# EAGLE design Arduino (EAGLE 9.5.2)
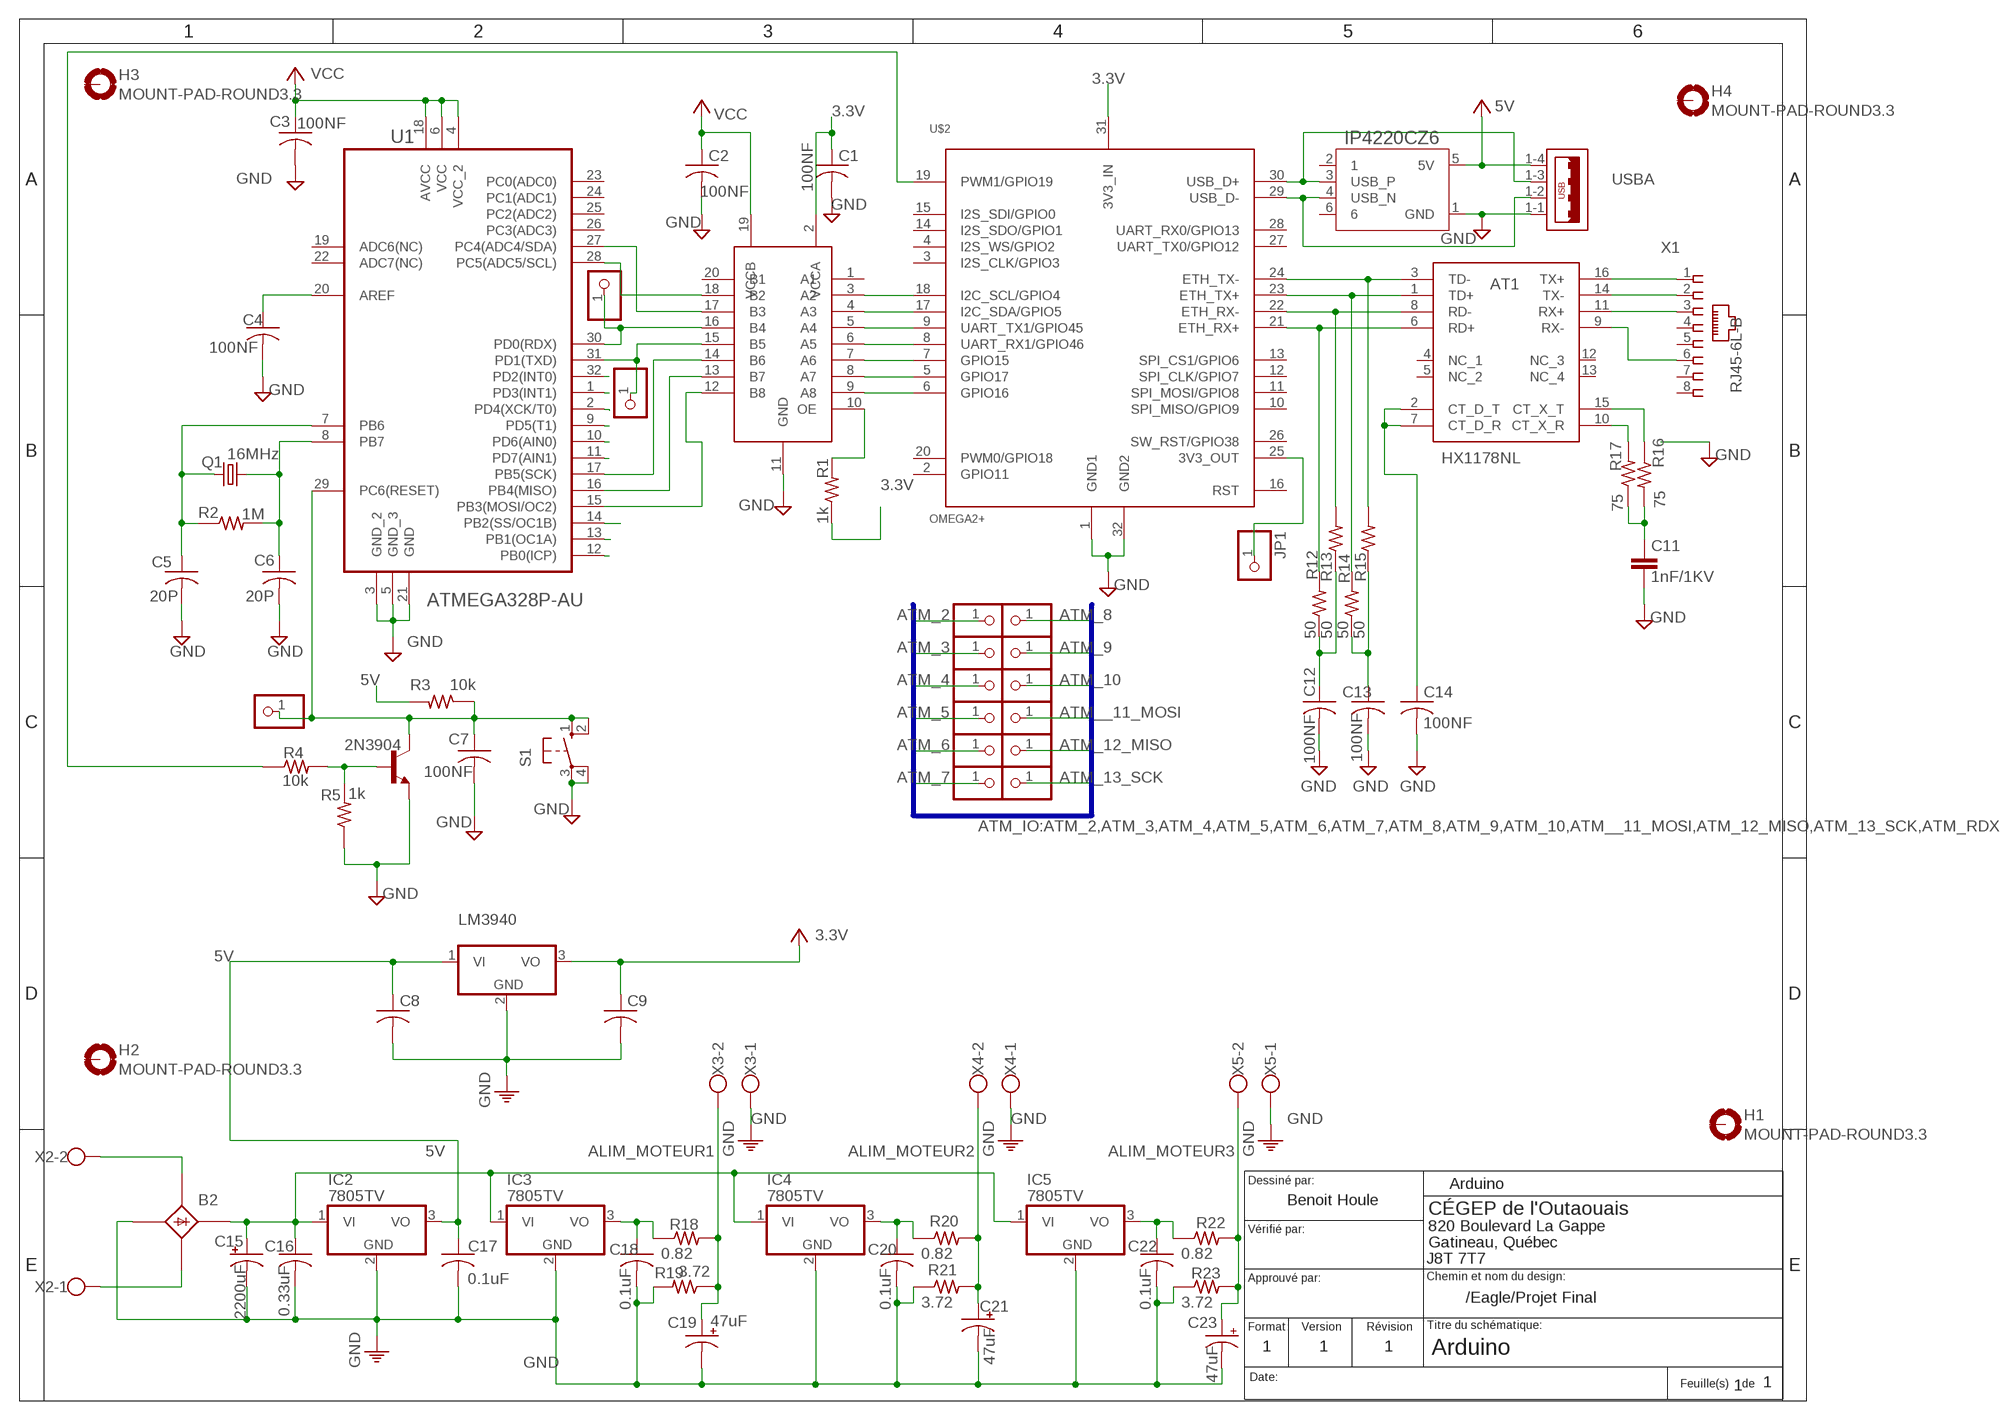
[diagram p0: schematic, sheet 1]

## Parts
AT1  HX1178NL  [SOP254P1283X647-16N]
B2  B25A-  [B25A-]
C1  100NF  CENPC0603K  [C0603K]
C2  100NF  CENPC0603K  [C0603K]
C3  100NF  CENPC0603K  [C0603K]
C4  100NF  CENPC0603K  [C0603K]
C5  20P  CENPC0603K  [C0603K]
C6  20P  CENPC0603K  [C0603K]
C7  100NF  CENPC0603K  [C0603K]
C8  CENPC1206K  [C1206K]
C9  CENPC1206K  [C1206K]
C11  1nF/1KV  CXC10B6  [XC10B6]
C12  100NF  CENPC0603K  [C0603K]
C13  100NF  CENPC0603K  [C0603K]
C14  100NF  CENPC0603K  [C0603K]
C15  2200uF  CPOL-USSANYO_B'  [SANYO-OSCON_B']
C16  0.33uF  CENPC0603K  [C0603K]
C17  0.1uF  CENPC0603K  [C0603K]
C18  0.1uF  CENPC0603K  [C0603K]
C19  47uF  CPOL-USSANYO_B'  [SANYO-OSCON_B']
C20  0.1uF  CENPC0603K  [C0603K]
C21  47uF  CPOL-USSANYO_B'  [SANYO-OSCON_B']
C22  0.1uF  CENPC0603K  [C0603K]
C23  47uF  CPOL-USSANYO_B'  [SANYO-OSCON_B']
FRAME1  CARTOUCHE_TGÉ  [CARTOUCHE]
H1  MOUNT-PAD-ROUND3.3  [3,3-PAD]
H2  MOUNT-PAD-ROUND3.3  [3,3-PAD]
H3  MOUNT-PAD-ROUND3.3  [3,3-PAD]
H4  MOUNT-PAD-ROUND3.3  [3,3-PAD]
IC2  7805TV  [TO220V]
IC3  7805TV  [TO220V]
IC4  7805TV  [TO220V]
IC5  7805TV  [TO220V]
IP4220CZ6  IP4220CZ6,125DIODE_SOT457_1P7X3P1-M  [DIODE_SOT457_1P7X3P1-M]
JP1  PINHD-1X1  [1X01]
JP2  PINHD-1X1  [1X01]
JP3  PINHD-1X1  [1X01]
JP4  PINHD-1X1  [1X01]
JP5  PINHD-1X1  [1X01]
JP6  PINHD-1X1  [1X01]
JP7  PINHD-1X1  [1X01]
JP8  PINHD-1X1  [1X01]
JP9  PINHD-1X1  [1X01]
JP10  PINHD-1X1  [1X01]
JP11  PINHD-1X1  [1X01]
JP12  PINHD-1X1  [1X01]
JP13  PINHD-1X1  [1X01]
JP14  PINHD-1X1  [1X01]
JP15  PINHD-1X1  [1X01]
JP16  PINHD-1X1  [1X01]
LM3940  7824TV  [TO220V]
Q1  16MHz  CRYSTALHC49S  [HC49/S]
R1  1k  RM1206  [M1206]
R2  1M  RM1206  [M1206]
R3  10k  RM1206  [M1206]
R4  10k  RM1206  [M1206]
R5  1k  RM3216  [M3216]
R12  50  RM1206  [M1206]
R13  50  RM1206  [M1206]
R14  50  RM1206  [M1206]
R15  50  RM1206  [M1206]
R16  75  RM1206  [M1206]
R17  75  RM1206  [M1206]
R18  0.82  R0309/10  [0309/10]
R19  3.72  R0309/10  [0309/10]
R20  0.82  R0309/10  [0309/10]
R21  3.72  R0309/10  [0309/10]
R22  0.82  R0309/10  [0309/10]
R23  3.72  R0309/10  [0309/10]
S1  10-XX  [B3F-10XX]
U1  ATMEGA328P-AU  [QFP80P900X900X120-32N]
U$1  TXS0108E  [TSSOP20]
U$2  OMEGA2+  [OMEGA2_PADS]
USB  USB_2P85-32003-00X-1  [USB2]
VERIFIER_TYPE  2N3904  [TO92]
X1  RJ45-6L-B  [RJ45-NO-SHIELD]
X2  W237-102  [W237-102]
X3  W237-102  [W237-102]
X4  W237-102  [W237-102]
X5  W237-102  [W237-102]

## Nets
3.3V: C1.1 C9.1 LM3940.3(VO) R1.1 U$1.2(VCCA) U$2.31(3V3_IN)
5V: C2.1 C3.1 C8.1 C17.1 IC2.3(VO) IP4220CZ6.5(5V) LM3940.1(VI) R3.2 U1.4(VCC_2) U1.6(VCC) U1.18(AVCC) U$1.19(VCCB) USB.1-4 ; supply symbol labelled VCC
ALIM_MOTEUR1: C19.+ R18.2 R19.1 X3.2
ALIM_MOTEUR2: C21.+ R20.2 R21.2 X4.2
ALIM_MOTEUR3: C23.+ R22.2 R23.2 X5.2
ATM_2: JP3.1 U1.32(PD2(INT0))
ATM_3: JP4.1 U1.1(PD3(INT1))
ATM_4: JP7.1 U1.2(PD4(XCK/T0))
ATM_5: JP8.1 U1.9(PD5(T1))
ATM_6: JP9.1 U1.10(PD6(AIN0))
ATM_7: JP10.1 U1.11(PD7(AIN1))
ATM_8: JP11.1 U1.12(PB0(ICP))
ATM_9: JP12.1 U1.13(PB1(OC1A))
ATM_10: JP13.1 U1.14(PB2(SS/OC1B))
ATM_12_MISO: JP15.1 U1.16(PB4(MISO)) U$1.13(B7)
ATM_13_SCK: JP16.1 U1.17(PB5(SCK)) U$1.14(B6)
ATM__11_MOSI: JP14.1 U1.15(PB3(MOSI/OC2)) U$1.12(B8)
ATM_RDX: JP5.1 U1.30(PD0(RDX)) U$1.16(B4)
ATM_SCI: U1.28(PC5(ADC5/SCL)) U$1.18(B2)
ATM_SDA: U1.27(PC4(ADC4/SDA)) U$1.17(B3)
ATM_TDX: JP6.1 U1.31(PD1(TXD)) U$1.15(B5)
GND: B2.-1(-) C1.2 C2.2 C3.2 C4.2 C5.2 C6.2 C7.2 C8.2 C9.2 C11.2 C12.2 C13.2 C14.2 C15.- C16.2 C17.2 C18.2 C19.- C20.2 C21.- C22.2 C23.- IC2.2(GND) IC3.2(GND) IC4.2(GND) IC5.2(GND) IP4220CZ6.1(GND) LM3940.2(GND) R5.1 R19.2 R21.1 R23.1 S1.3(P) S1.4(P1) U1.3(GND_2) U1.5(GND_3) U1.21(GND) U$1.11(GND) U$2.1(GND1) U$2.32(GND2) USB.1-1 VERIFIER_TYPE.3(E) X3.1 X4.1 X5.1
MCU_RESET: C7.1 JP2.1 R3.1 S1.1(S) S1.2(S1) U1.29(PC6(RESET)) VERIFIER_TYPE.1(C)
N$1: R1.2 U$1.10(OE)
N$2: C4.1 U1.20(AREF)
N$3: C6.1 Q1.2 R2.2 U1.8(PB7)
N$4: C5.1 Q1.1 R2.1 U1.7(PB6)
N$6: C11.1 R16.2 R17.1
N$7: AT1.2(CT_D_T) AT1.7(CT_D_R) C14.1
N$8: AT1.15(CT_X_T) R16.1
N$9: AT1.10(CT_X_R) R17.2
N$10: R4.1 U$2.19(PWM1/GPIO19)
N$11: B2.AC1-(AC1) X2.2
N$12: B2.AC2-(AC2) X2.1
N$13: C18.1 IC3.3(VO) R18.1
N$15: C20.1 IC4.3(VO) R20.1
N$18: C22.1 IC5.3(VO) R22.1
N$25: R4.2 R5.2 VERIFIER_TYPE.2(B)
N$28: IP4220CZ6.3(USB_P) U$2.30(USB_D+) USB.1-3
N$30: IP4220CZ6.4(USB_N) U$2.29(USB_D-) USB.1-2
N$36: AT1.3(TD-) R15.2 U$2.24(ETH_TX-)
N$37: AT1.1(TD+) R14.2 U$2.23(ETH_TX+)
N$38: AT1.8(RD-) R13.2 U$2.22(ETH_RX-)
N$39: AT1.6(RD+) R12.2 U$2.21(ETH_RX+)
N$40: AT1.16(TX+) X1.1
N$41: AT1.14(TX-) X1.2
N$42: AT1.11(RX+) X1.3
N$43: AT1.9(RX-) X1.6
N$47: C12.1 R12.1 R13.1
N$48: C13.1 R14.1 R15.1
OM_IO15: U$1.7(A6) U$2.7(GPIO15)
OM_IO16: U$1.9(A8) U$2.6(GPIO16)
OM_IO17: U$1.8(A7) U$2.5(GPIO17)
OM_RXD1: U$1.6(A5) U$2.8(UART_RX1/GPIO46)
OM_SCI: U$1.3(A2) U$2.18(I2C_SCL/GPIO4)
OM_SDA: U$1.4(A3) U$2.17(I2C_SDA/GPIO5)
OM_TXD1: U$1.5(A4) U$2.9(UART_TX1/GPIO45)
TP_3.3_OMEGA: JP1.1 U$2.25(3V3_OUT)
VIN_7805: B2.+1(+) C15.+ C16.1 IC2.1(VI) IC3.1(VI) IC4.1(VI) IC5.1(VI)
Unconnected: AT1.4(NC_1) AT1.5(NC_2) AT1.12(NC_3) AT1.13(NC_4) B2.+ B2.- B2.AC1 B2.AC2 H1.B3,3(MOUNT) H2.B3,3(MOUNT) H3.B3,3(MOUNT) H4.B3,3(MOUNT) IP4220CZ6.2 IP4220CZ6.6 U1.19(ADC6(NC)) U1.22(ADC7(NC)) U1.23(PC0(ADC0)) U1.24(PC1(ADC1)) U1.25(PC2(ADC2)) U1.26(PC3(ADC3)) U$1.1(A1) U$1.20(B1) U$2.2(GPIO11) U$2.3(I2S_CLK/GPIO3) U$2.4(I2S_WS/GPIO2) U$2.10(SPI_MISO/GPIO9) U$2.11(SPI_MOSI/GPIO8) U$2.12(SPI_CLK/GPIO7) U$2.13(SPI_CS1/GPIO6) U$2.14(I2S_SDO/GPIO1) U$2.15(I2S_SDI/GPIO0) U$2.16(RST) U$2.20(PWM0/GPIO18) U$2.26(SW_RST/GPIO38) U$2.27(UART_TX0/GPIO12) U$2.28(UART_RX0/GPIO13) USB.2-1 USB.2-2 USB.2-3 USB.2-4 X1.4 X1.5 X1.7 X1.8

## Buses
ATM_IO:ATM_2,ATM_3,ATM_4,ATM_5,ATM_6,ATM_7,ATM_8,ATM_9,ATM_10,ATM__11_MOSI,ATM_12_MISO,ATM_13_SCK,ATM_RDX,ATM_TDX

## Notes on the sheet
- Arduino
- Benoit Houle
- /Eagle/Projet Final
- 1 | 1 | 1
- 1 | 1

## Library data of the parts
AT1 = SamacSys_Parts:HX1178NL: Audio Transformers / Signal Transformers 10/100Base-T SMD 1-Port Source: Datasheet <https://ms.componentsearchengine.com/Datasheets/1/HX1178NL.pdf>; DESCRIPTION: Audio Transformers / Signal Transformers 10/100Base-T SMD 1-Port; HEIGHT: 6.47mm; MANUFACTURER_NAME: Pulse; MANUFACTURER_PART_NUMBER: HX1178NL
B2 = rectifier:B25A-: RECTIFIER 25-A bridge
C1-C9 C12-C14 C16-C18 C20 C22 = 1_TGE-sur G:CENP: Condensateur electrolytique non-polarisé
C11 = 1_TGE-sur G:C: Condensateur
C15 C19 C21 C23 = rcl:CPOL-US: POLARIZED CAPACITOR, American symbol; SPICEPREFIX: C
FRAME1 = 1_TGE-sur G:CARTOUCHE_TGÉ: Cartouche de TGÉ: Grandeur A, dimention 8 1/2 x 11 pouces, orientation portrait. Les élèves doivent utiliser la commande TEXT pour placer les valeurs aux champs appropriés. Couche 100 Cartouche, ne pas oublier de créer cette couche! Size par défaut: 0,07 ou ajusté en conséquence si pas asez d'espace. Ratio: 8% Font: Vector. Voir la commande TEXT pour plus d'information.
H1-H4 = holes:MOUNT-PAD-ROUND: MOUNTING PAD, round
IC2-IC5 LM3940 = linear:78*: Positive VOLTAGE REGULATOR Source: http://cache.national.com/ds/LM/LM78L05.pdf http://www.fairchildsemi.com/ds/LM/LM7805.pdf
IP4220CZ6 = IP4220CZ6:IP4220CZ6,125; BUILT_BY: EMA_Anthony; COPYRIGHT: Copyright (C) 2016 Accelerated Designs. All rights reserved; MANUFACTURER_PART_NUMBER: IP4220CZ6,125; VENDOR: Nexperia
JP1-JP16 = 1mylib:PINHD-1X1: PIN HEADER
Q1 = crystal:CRYSTAL: CRYSTAL; OC_FARNELL: 1667008; OC_NEWARK: unknown
R1-R5 R12-R23 = 1_TGE-sur G:R: R
S1 = switch-omron:10-XX: OMRON SWITCH; MPN: B3F-1000; OC_FARNELL: 176432; OC_NEWARK: 36M3542
U1 = Atmel_By_element14_Batch_1-00:ATMEGA328P-AU: 8-bit Microcontroller with In-System Programmable Flash; MPN: ATMEGA328P-AU; OC_FARNELL: 1715486; OC_NEWARK: 14R4631; PACKAGE: TQFP-32; SUPPLIER: Atmel
U$1 = Synapseware-transistors:TXS0108E: 8-BIT BIDIRECTIONAL VOLTAGE-LEVEL TRANSLATOR FOR OPEN-DRAIN AND PUSH-PULL APPLICATIONS
U$2 = OnionOmega2:OMEGA2+: Onion Omega2+; FLASH: 32MB; RAM: 128MB
USB = 1_TGE-sur G:USB_2P
VERIFIER_TYPE = transistor:2N3904: NPN TRANSISTOR
X1 = con-tycoelectronics:RJ45: CORCOM Modular RJ Jacks No Shield Source: www.tycoelectronics.com .. ENG_DS_1654001_1099_RJ_L_0507.pdf; MPN: RJ45-6L-B; OC_FARNELL: unknown; OC_NEWARK: 16R6090
X2-X5 = con-wago-500:W237-102: WAGO SCREW CLAMP; MPN: 237-102; OC_FARNELL: unknown; OC_NEWARK: 70K9898

## Board
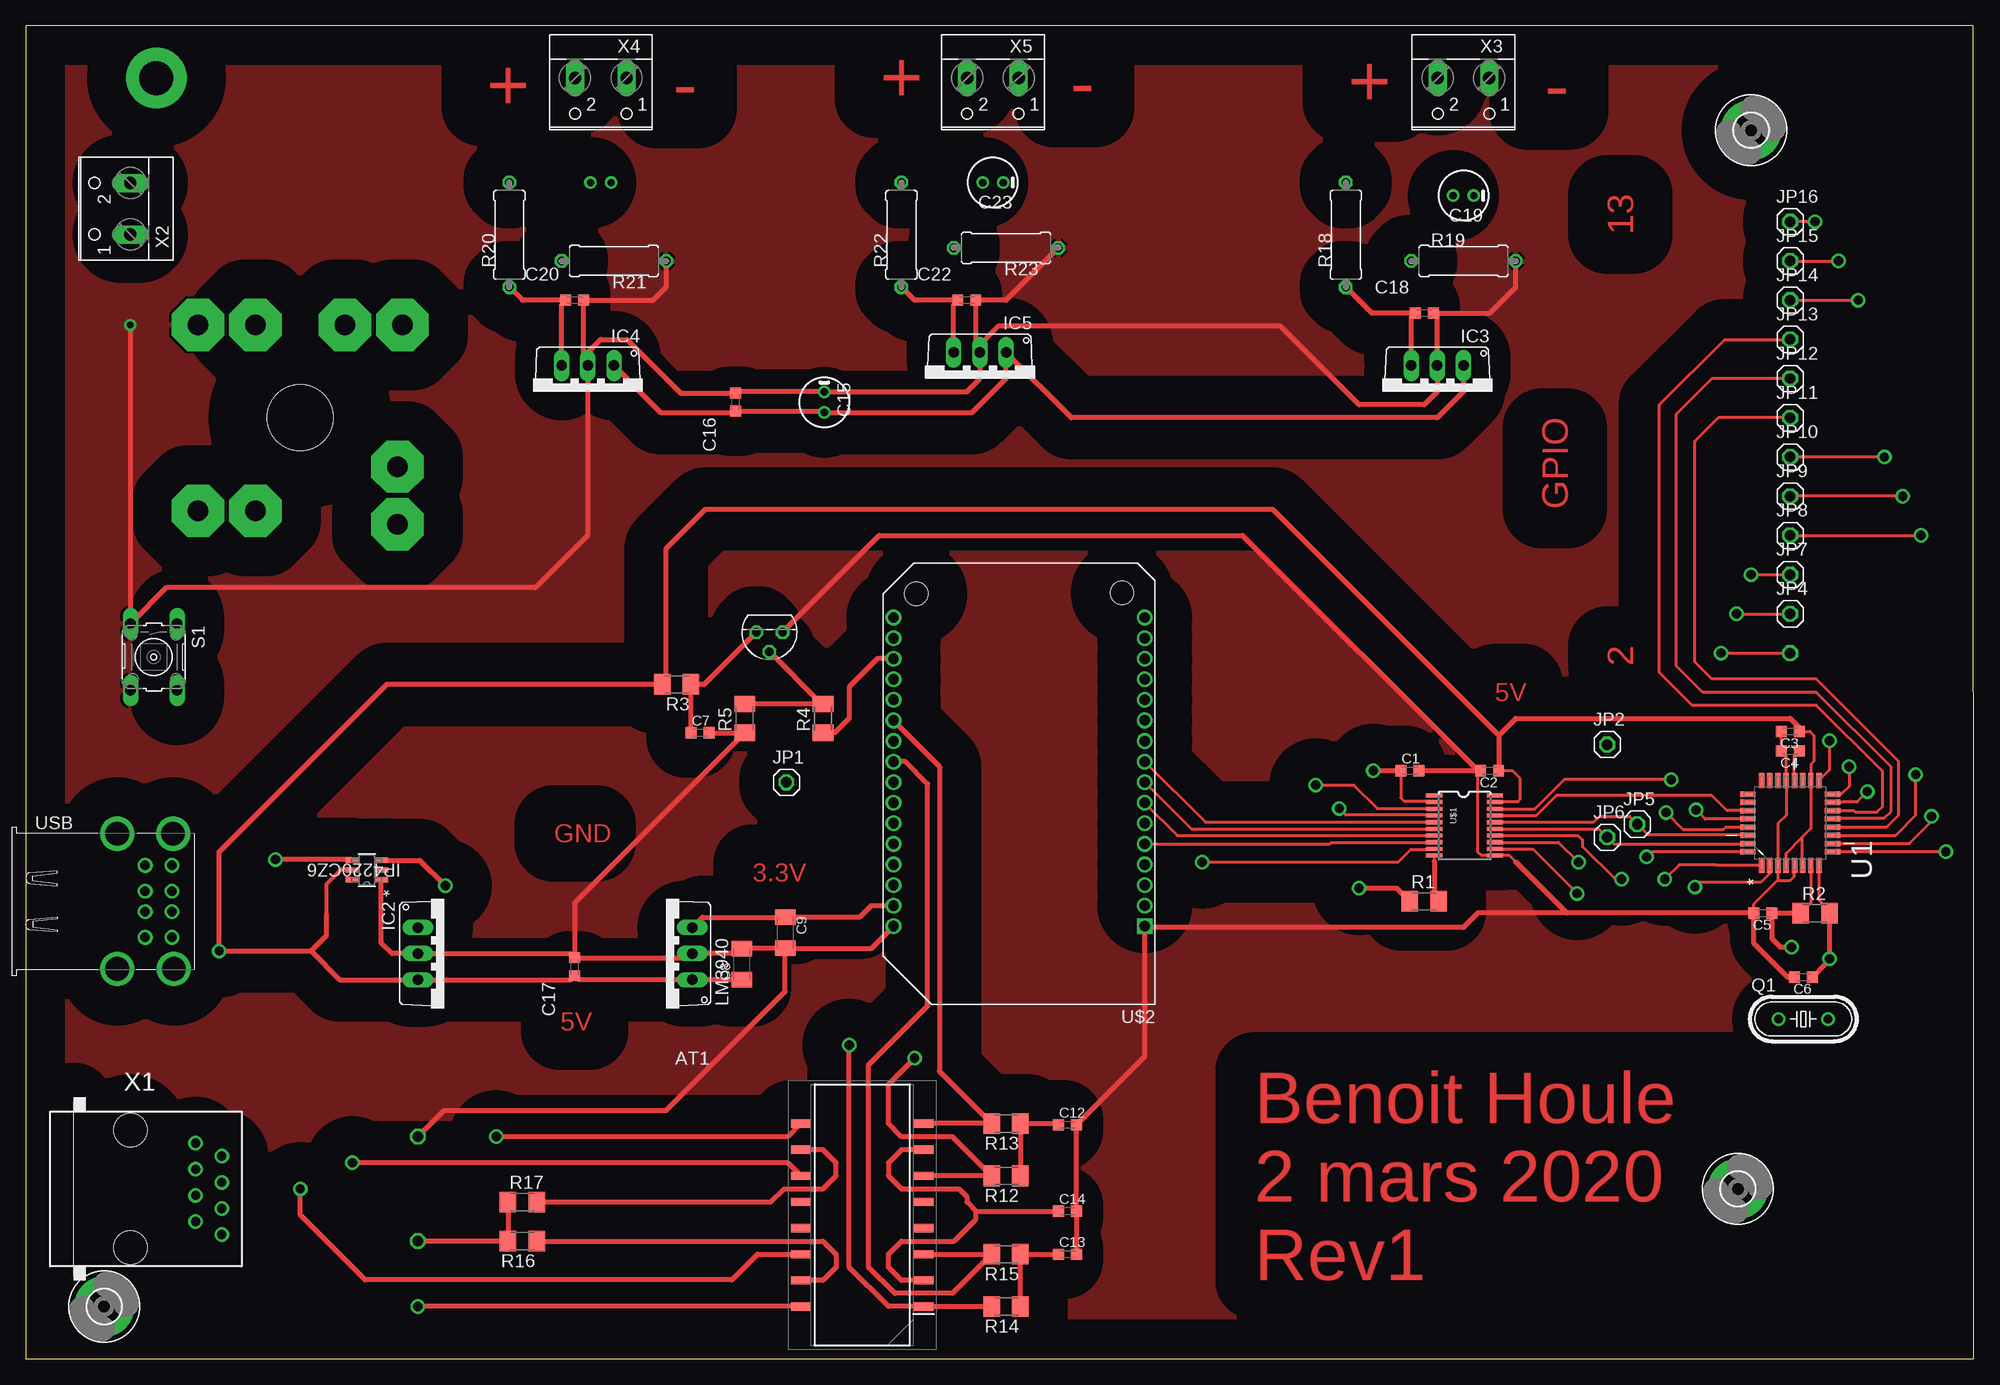
[diagram p1: board, top side]
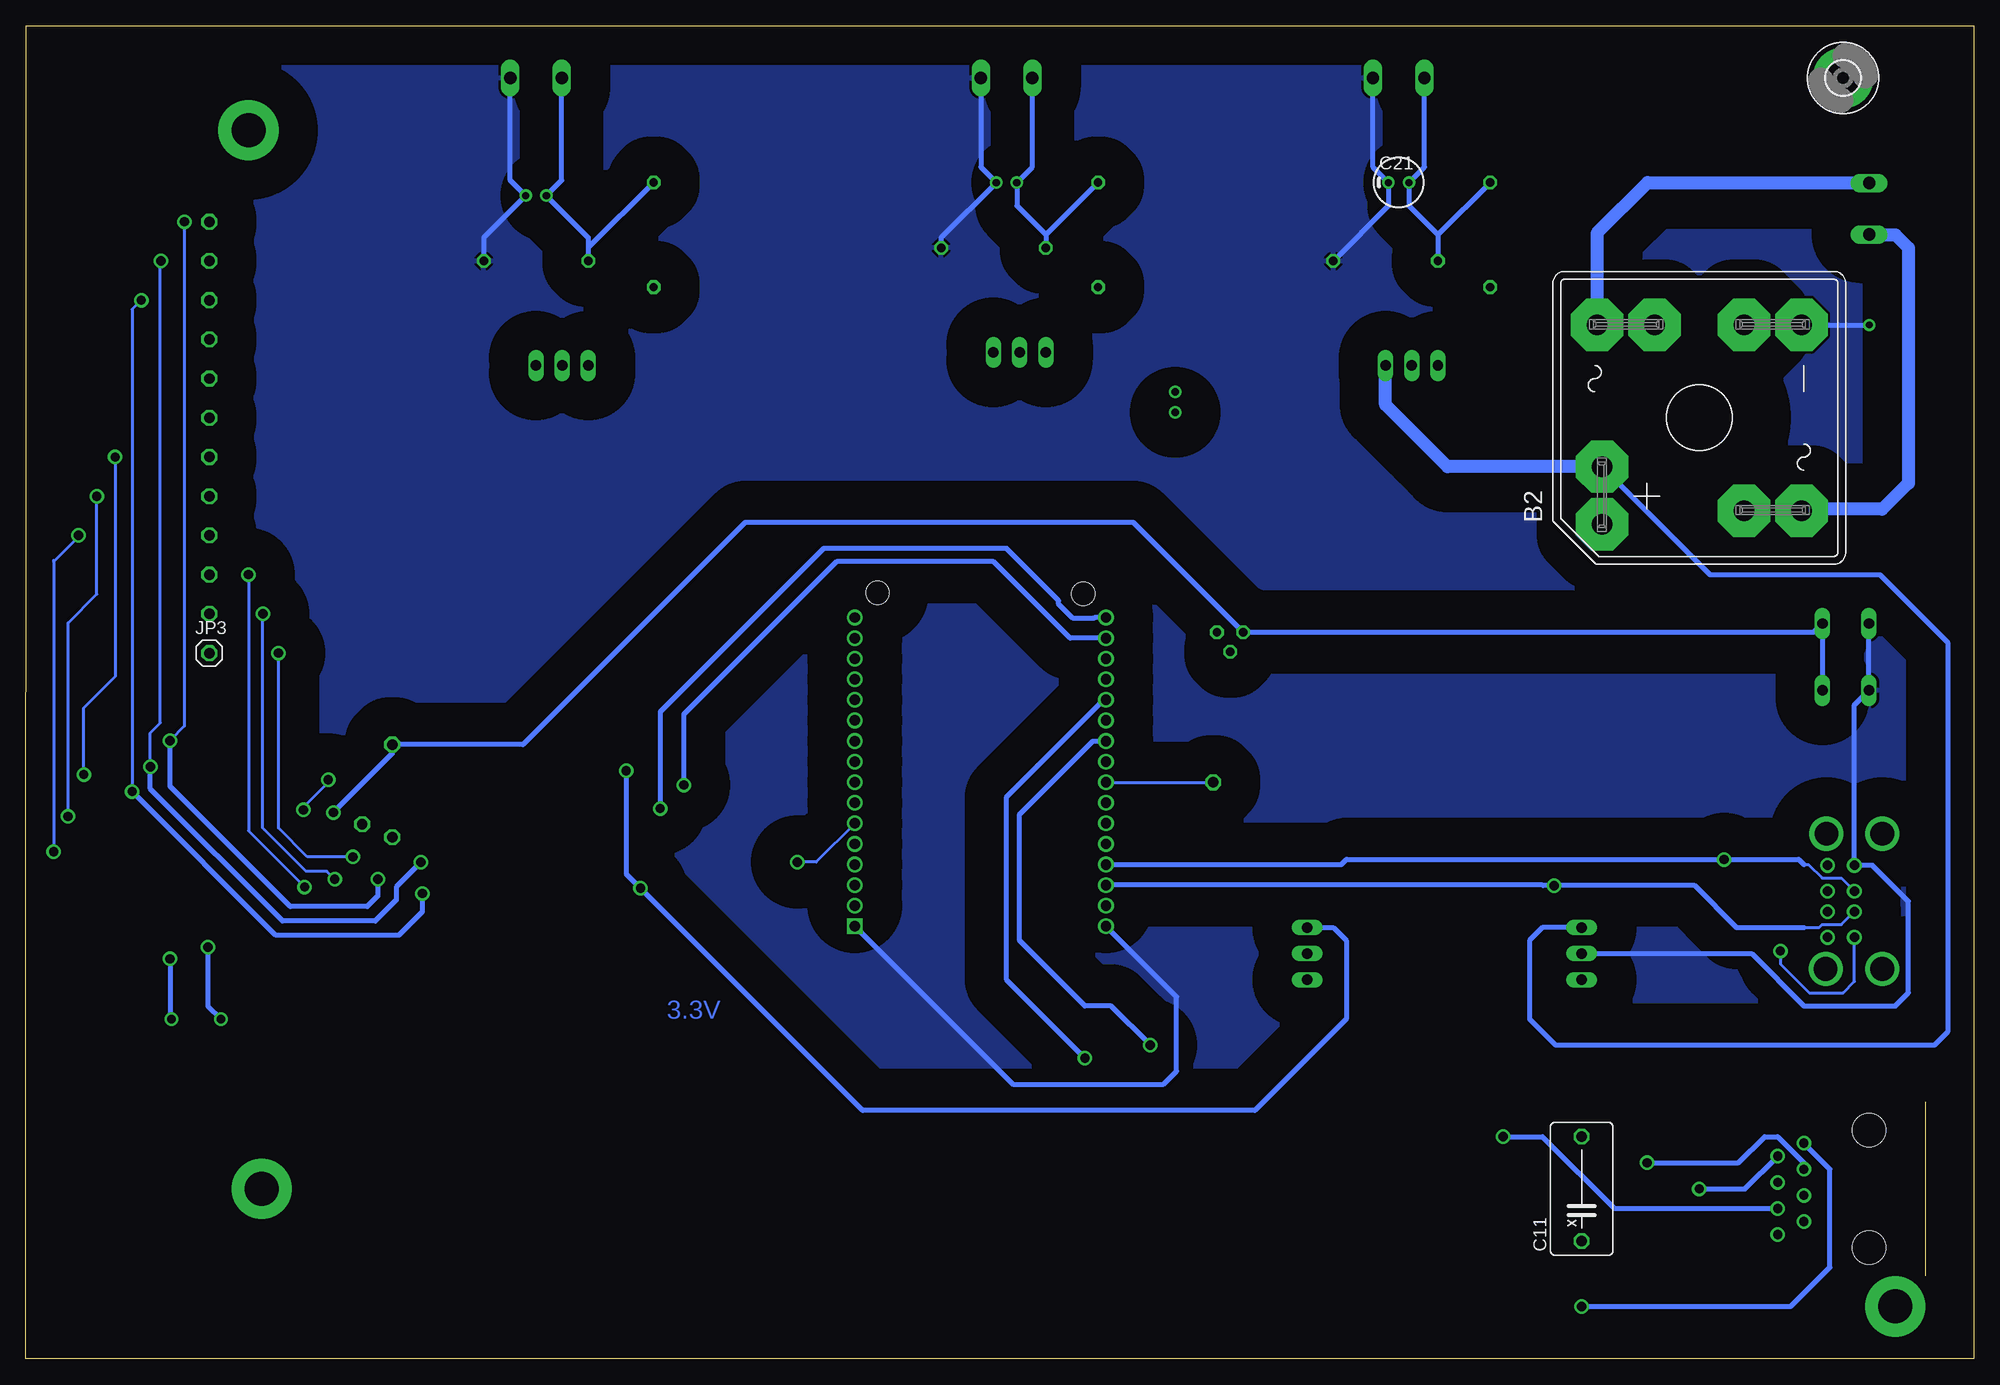
[diagram p2: board, bottom side, seen from below]

Size 189.28 x 129.54 mm. Coordinates in mm from the lower left corner, seen from the top.
Outline: 0,0 189.28,0 189.23,129.54 0,129.53 0,0
Copper layers (1*16): Top 0.035mm / dielectric 1.5mm / Bottom 0.035mm
Design rules "default *": minimum track width 10mil, minimum drill 10mil, track to track 10mil, track to pad 15mil, pad to pad 15mil, via to via 20mil, smd to smd 20mil, copper to edge 20mil, drill to drill 10mil, minimum pad ring 10mil, minimum via ring 10mil, stop-mask expansion 20mil, vias tented up to drill 10mil, thermal gap 10mil

### Footprints (pad centres in the part's own frame; a part is rotated, then mirrored left to right if it is on the bottom)
SOP254P1283X647-16N = smd 1.97 x 0.8: 1 -5.94,8.89; 2 -5.94,6.35; 3 -5.94,3.81; 4 -5.94,1.27; 5 -5.94,-1.27; 6 -5.94,-3.81; 7 -5.94,-6.35; 8 -5.94,-8.89; 9 5.94,-8.89; 10 5.94,-6.35; 11 5.94,-3.81; 12 5.94,-1.27; 13 5.94,1.27; 14 5.94,3.81; 15 5.94,6.35; 16 5.94,8.89
B25A- = drill 2.007 pad 5.08 octagon: + -10.338,9.449; +1 -4.75,9.449; - 9.042,-4.343; -1 9.042,-9.931; AC1 9.042,4.343; AC1- 9.042,9.931; AC2 -9.042,-4.343; AC2- -9.042,-9.931 | hole 6.401: 0,0
C0603K = smd 1.05 x 1.08: 1 -0.875,0; 2 0.875,0
C1206K = smd 1.5 x 2: 1 -1.5,0; 2 1.5,0
XC10B6 = drill 1.016 octagon: 1 -5.08,0; 2 5.08,0
SANYO-OSCON_B' = drill 0.7 pad 1.1: + 1,0; - -1,0
3,3-PAD = drill 3.3 pad 5.842: B3,3 0,0
TO220V = drill 1.016 long: 1 -2.54,-2.54; 2 0,-2.54; 3 2.54,-2.54
DIODE_SOT457_1P7X3P1-M = smd 1.308 x 0.508: 1 -1.403,0.95; 2 -1.403,0; 3 -1.403,-0.95; 4 1.403,-0.95; 5 1.403,0; 6 1.403,0.95
1X01 = drill 1.016 octagon: 1 0,0
HC49/S = drill 0.813: 1 -2.413,0; 2 2.413,0
M1206 = smd 1.6 x 2: 1 -1.4,0; 2 1.4,0
M3216 = smd 1.6 x 2: 1 -1.4,0; 2 1.4,0
0309/10 = drill 0.813 octagon: 1 -5.08,0; 2 5.08,0
B3F-10XX = drill 1.016 long: 1 -3.251,2.261; 2 3.251,2.261; 3 -3.251,-2.261; 4 3.251,-2.261
QFP80P900X900X120-32N = smd 1.473 x 0.508: 1 -4.115,2.794; 2 -4.115,2.007; 3 -4.115,1.194; 4 -4.115,0.406; 5 -4.115,-0.406; 6 -4.115,-1.194; 7 -4.115,-2.007; 8 -4.115,-2.794; 17 4.115,-2.794; 18 4.115,-2.007; 19 4.115,-1.194; 20 4.115,-0.406; 21 4.115,0.406; 22 4.115,1.194; 23 4.115,2.007; 24 4.115,2.794 | smd 0.508 x 1.473: 9 -2.794,-4.115; 10 -2.007,-4.115; 11 -1.194,-4.115; 12 -0.406,-4.115; 13 0.406,-4.115; 14 1.194,-4.115; 15 2.007,-4.115; 16 2.794,-4.115; 25 2.794,4.115; 26 2.007,4.115; 27 1.194,4.115; 28 0.406,4.115; 29 -0.406,4.115; 30 -1.194,4.115; 31 -2.007,4.115; 32 -2.794,4.115
TSSOP20 = smd 0.4 x 1.6: 1 -2.675,-2.85; 2 -2.025,-2.85; 3 -1.375,-2.85; 4 -0.725,-2.85; 5 -0.075,-2.85; 6 0.575,-2.85; 7 1.225,-2.85; 8 1.875,-2.85; 9 2.525,-2.85; 10 3.175,-2.85; 11 3.175,3.05; 12 2.525,3.05; 13 1.875,3.05; 14 1.225,3.05; 15 0.575,3.05; 16 -0.075,3.05; 17 -0.725,3.05; 18 -1.375,3.05; 19 -2.025,3.05; 20 -2.675,3.05
OMEGA2_PADS = drill 1.015 square: 1 -12.2,13.85 | drill 1.015: 2 -12.2,11.85; 3 -12.2,9.85; 4 -12.2,7.85; 5 -12.2,5.85; 6 -12.2,3.85; 7 -12.2,1.85; 8 -12.2,-0.15; 9 -12.2,-2.15; 10 -12.2,-4.15; 11 -12.2,-6.15; 12 -12.2,-8.15; 13 -12.2,-10.15; 14 -12.2,-12.15; 15 -12.2,-14.15; 16 -12.2,-16.15; 17 12.2,-16.15; 18 12.2,-14.15; 19 12.2,-12.15; 20 12.2,-10.15; 21 12.2,-8.15; 22 12.2,-6.15; 23 12.2,-4.15; 24 12.2,-2.15; 25 12.2,-0.15; 26 12.2,1.85; 27 12.2,3.85; 28 12.2,5.85; 29 12.2,7.85; 30 12.2,9.85; 31 12.2,11.85; 32 12.2,13.85 | hole 2.25: 10,-18.45; -10,-18.55
USB2 = drill 0.92 pad 1.27: 1-1 2.71,3.5; 1-2 2.71,1; 1-3 2.71,-1; 1-4 2.71,-3.5; 2-1 5.33,3.5; 2-2 5.33,1; 2-3 5.33,-1; 2-4 5.33,-3.5 | drill 2.3 pad 3: M1 0,6.57; M2 0,-6.57; M3 5.426,6.57; M4 5.502,-6.57
TO92 = drill 0.813 octagon: 1 1.27,0; 2 0,1.905; 3 -1.27,0
RJ45-NO-SHIELD = drill 0.9 pad 1.4: 1 -4.445,6.35; 2 -3.175,8.89; 3 -1.905,6.35; 4 -0.635,8.89; 5 0.635,6.35; 6 1.905,8.89; 7 3.175,6.35; 8 4.445,8.89 | hole 3.251: -5.715,0; 5.715,0
W237-102 = drill 1.194 long: 1 -2.5,-1.27; 2 2.5,-1.27

### Placement (x,y rotation side)
AT1  81.28,13.97 180 top
B2  26.67,91.44 90 bottom
C1  134.49,57.15 0 top
C2  142.24,57.15 180 top
C3  171.45,60.96 180 top
C4  171.45,59.05 180 top
C5  168.78,43.31 180 top
C6  172.72,37.08 180 top
C7  65.53,60.83 0 top
C8  69.6,38.35 90 top
C9  73.79,41.4 270 top
C11  38.1,16.51 90 bottom
C12  101.22,22.73 0 top
C13  101.22,10.16 0 top
C14  101.22,14.35 0 top
C15  77.6,92.96 270 top
C16  68.96,92.96 90 top
C17  53.34,38.1 90 top
C18  135.89,101.6 0 top
C19  139.7,113.03 180 top
C20  53.34,102.87 0 top
C21  55.88,114.3 0 bottom
C22  91.44,102.87 0 top
C23  93.98,114.3 180 top
FRAME1  -38.1,-55.88 0 top  (outside the outline)
H1  12.7,124.46 0 bottom
H2  166.37,16.51 0 top
H3  167.64,119.38 0 top
H4  7.62,5.08 0 top
IC2  40.64,39.37 270 top
IC3  137.16,93.98 180 top
IC4  54.61,93.98 180 top
IC5  92.71,95.25 180 top
IP4220CZ6  33.15,47.5 180 top
JP1  73.91,56.01 0 top
JP2  153.67,59.69 0 top
JP3  171.45,68.58 0 bottom
JP4  171.45,72.39 0 top
JP5  156.59,51.94 0 top
JP6  153.67,50.67 0 top
JP7  171.45,76.2 0 top
JP8  171.45,80.01 0 top
JP9  171.45,83.82 0 top
JP10  171.45,87.63 0 top
JP11  171.45,91.44 0 top
JP12  171.45,95.25 0 top
JP13  171.45,99.06 0 top
JP14  171.45,102.87 0 top
JP15  171.45,106.68 0 top
JP16  171.45,110.49 0 top
LM3940  62.23,39.37 90 top
Q1  172.72,33.02 0 top
R1  135.89,44.45 0 top
R2  173.86,43.31 0 top
R3  63.25,65.53 180 top
R4  77.47,62.23 90 top
R5  69.85,62.23 90 top
R12  95.25,17.78 180 top
R13  95.25,22.86 180 top
R14  95.25,5.08 180 top
R15  95.25,10.16 180 top
R16  48.26,11.43 180 top
R17  48.26,15.24 0 top
R18  128.27,109.22 90 top
R19  139.7,106.68 0 top
R20  46.99,109.22 90 top
R21  57.15,106.68 180 top
R22  85.09,109.22 90 top
R23  95.25,107.95 180 top
S1  12.45,68.2 270 top
U1  171.45,52.07 90 top
U$1  139.7,52.07 270 top
U$2  96.52,55.88 180 top
USB  8.89,44.45 0 top
VERIFIER_TYPE  72.26,70.61 180 top
X1  10.16,16.51 270 top
X2  8.89,111.76 90 top
X3  139.7,123.19 180 top
X4  55.88,123.19 180 top
X5  93.98,123.19 180 top

### Tracks (layer width: path | path; a pad name or v marks a point on that pad's centre or on a via)
3.3V  (via drill 0.9)
  Top 0.305: U$1.2 136.81,54.14 133.98,54.14 133.61,54.5 C1.1
  Top 0.508: LM3940.3 65.76,42.9 C9.1 81,42.9 82.13,44.03 U$2.31 | v130.94,57.15 C1.1 | R1.1 133.22,45.72 v129.54,45.72
  Bottom 0.508: LM3940.3 62.23,41.91 60.96,40.64 60.96,33.02 69.85,24.13 107.95,24.13 v129.54,45.72 130.94,47.12 v130.94,57.15
5V  (via drill 0.9)
  Top 0.305: U$1.19 142.79,54.14 144.99,54.14 145.23,54.38 145.23,56.38 144.46,57.15 C2.1 | 172.52,60.76 C3.1 173.36,60.96 173.74,60.58 173.74,58.04 173.46,57.76 U1.18 173.46,51.54 172.64,50.72 | 172.64,50.72 171.04,49.12 U1.4 | U1.6 172.64,50.72
  Top 0.406: IP4220CZ6.5 30.61,47.5 29.21,46.1 29.21,43.14
  Top 0.508: C8.1 64.79,36.85 LM3940.1 53.73,36.83 C17.1 52.95,36.83 IC2.3 30.52,36.83 27.73,39.62 | 27.73,39.62 v18.8,39.62 18.8,49.28 35.05,65.53 R3.2 62.23,65.92 62.23,78.74 66.04,82.55 121.16,82.55 143.13,60.58 | 143.13,60.58 143.13,57.16 C2.1 | 172.52,60.76 172.52,61.16 171.45,62.23 144.78,62.23 143.13,60.58 | 29.21,43.14 29.21,41.11 27.73,39.62
  Bottom 0.305: USB.1-4 11.6,36.66 12.7,35.56 16,35.56 18.8,38.35 v18.8,39.62
ALIM_MOTEUR1
  Bottom 0.508: X3.2 137.2,114.53 C19.+ 134.62,108.95 134.62,107.95 | R18.2 134.62,107.95 | 134.62,107.95 R19.1
ALIM_MOTEUR2
  Bottom 0.508: X4.2 53.38,115.8 C21.+ 54.88,112.03 52.07,109.22 | R20.2 52.07,109.22 | 52.07,109.22 R21.2
ALIM_MOTEUR3
  Bottom 0.508: X5.2 91.48,115.8 C23.+ 92.98,112.03 90.17,109.22 | R22.2 90.17,109.22 | 90.17,109.22 R23.2
ATM_2  (via drill 0.9)
  Top 0.305: U1.32 157.99,49.28 v157.48,48.77 | v164.72,68.58 JP3.1
  Bottom 0.305: v157.48,48.77 161.93,48.77 164.72,51.56 v164.72,68.58
ATM_3  (via drill 0.9)
  Top 0.305: U1.1 164.26,47.95 164.21,48.01 160.66,48.01 v159.26,46.61 | v166.24,72.39 JP4.1
  Bottom 0.305: v159.26,46.61 160.02,47.37 162.05,47.37 166.24,51.56 v166.24,72.39
ATM_4  (via drill 0.9)
  Top 0.305: v162.18,45.85 162.64,46.3 168.57,46.3 169.44,47.18 U1.2 | v167.64,76.2 JP7.1
  Bottom 0.305: v162.18,45.85 167.64,51.31 v167.64,76.2
ATM_5  (via drill 0.9)
  Top 0.305: JP8.1 v184.15,80.01 | v186.56,49.28 U1.9
  Bottom 0.305: 186.56,77.6 186.56,77.47 | 186.56,77.47 v186.56,49.28 | 186.56,77.47 184.15,79.88 v184.15,80.01
ATM_6  (via drill 0.9)
  Top 0.305: U1.10 183.03,50.06 185.17,52.2 v185.17,52.7 | v182.37,83.82 JP9.1
  Bottom 0.305: v185.17,52.7 185.17,71.5 182.37,74.3 v182.37,83.82
ATM_7  (via drill 0.9)
  Top 0.305: U1.11 181.69,50.88 183.64,52.83 v183.64,56.77 | v180.59,87.63 JP10.1
  Bottom 0.305: v183.64,56.77 183.64,63.25 180.59,66.29 v180.59,87.63
ATM_8
  Top 0.305: JP11.1 164.47,91.44 162.18,89.15 162.18,67.69 163.83,66.04 173.99,66.04 181.99,58.04 181.99,52.83 180.85,51.69 175.59,51.69 U1.12
ATM_9
  Top 0.305: JP12.1 163.83,95.25 160.4,91.82 160.4,67.31 162.94,64.77 173.99,64.77 181.25,57.51 181.25,53.21 180.6,52.56 175.65,52.56 U1.13
ATM_10
  Top 0.305: U1.14 177.63,53.26 177.77,53.12 179.86,53.12 180.44,53.69 180.44,57.05 173.99,63.5 161.93,63.5 158.75,66.68 158.75,92.71 165.1,99.06 JP13.1
ATM_12_MISO  (via drill 0.9)
  Top 0.305: U$1.13 148.94,50.2 v150.88,48.26 | JP15.1 v176.15,106.68 | v177.16,57.53 177.16,55.63 176.4,54.86 U1.16
  Bottom 0.305: v177.16,57.53 177.16,60.83 176.2,61.79 176.2,106.68 v176.15,106.68
  Bottom 0.508: v177.16,57.53 177.16,55.37 164.34,42.54 155.32,42.54 153.29,44.58 153.29,45.85 v150.88,48.26
ATM_13_SCK  (via drill 0.9)
  Top 0.305: U$1.14 150.83,50.84 151.26,50.42 151.26,49.78 154.43,46.61 v155.07,46.61 | v175.26,60.07 175.26,57.2 U1.17 | v173.86,110.49 JP16.1
  Bottom 0.305: v173.86,110.49 173.86,61.47 v175.26,60.07
  Bottom 0.508: v175.26,60.07 175.26,55.63 163.58,43.94 156.08,43.94 155.07,44.96 v155.07,46.61
ATM__11_MOSI  (via drill 0.9)
  Top 0.305: U$1.12 142.77,49.53 146.43,49.53 v150.75,45.21 | JP14.1 v178.05,102.87 | v178.94,55.12 177.93,54.1 176.55,54.1 176.52,54.08 U1.15
  Bottom 0.305: v178.05,102.87 178.94,101.98 v178.94,55.12
  Bottom 0.508: v178.94,55.12 164.97,41.15 153.03,41.15 150.75,43.43 v150.75,45.21
ATM_RDX
  Top 0.305: U1.30 167.26,50.8 167.18,50.88 157.65,50.88 JP5.1 155.83,52.7 152.91,52.7 152.35,52.15 U$1.16
ATM_SCI  (via drill 0.9)
  Top 0.305: v159.89,56.26 159.84,56.31 149.5,56.31 146.64,53.45 U$1.18 | U1.28 167.31,52.45 163.19,52.45 v162.31,53.34
  Bottom 0.305: v162.31,53.34 162.31,53.59 159.89,56.01 v159.89,56.26
ATM_SDA
  Top 0.305: U$1.17 146.78,52.79 148.72,54.74 163.83,54.74 165.3,53.26 U1.27
ATM_TDX
  Top 0.305: U1.31 167.31,50.04 154.31,50.04 JP6.1 152.85,51.49 U$1.15
GND  (via drill 0.65)
  Top 0.305: C3.2 C4.2 171.04,58.59 U1.21 171.04,52.81 170.26,52.02 U1.3 170.26,46.53 | 170.26,46.53 170.31,46.48 171.45,46.48 171.86,46.89 U1.5 | C5.2 167.91,44.18 170.26,46.53 | 144.78,48.26 144.15,48.9 U$1.11 141.48,48.9 141.1,49.28 141.1,57.15
  Top 0.508: C13.2 C14.2 C12.2 108.72,29.36 U$2.1 108.84,41.91 139.7,41.91 141.1,43.31 149.73,43.31 | C9.2 73.74,39.85 C8.2 69.11,39.37 LM3940.2 64.38,38.98 C17.2 | C9.2 82.19,39.9 U$2.32 | IP4220CZ6.1 34.55,40.38 35.56,39.37 IC2.2 52.95,39.37 C17.2 | 92.31,98.19 IC5.2 92.71,95.25 91.44,93.98 77.61,93.98 C15.- 69.09,93.96 C16.2 63.64,93.84 58.42,99.06 55.88,99.06 54.21,97.4 | 92.31,98.19 C22.2 95.25,102.87 R23.1 | 54.21,97.4 C20.2 60.96,102.87 62.23,104.14 R21.1 | 92.31,98.19 94.46,100.33 121.92,100.33 129.54,92.71 135.89,92.71 137.16,93.98 IC3.2 137.16,101.6 C18.2 142.24,101.6 144.78,104.14 R19.2 | 54.21,97.4 54.21,96.91 IC4.2 54.61,80.01 49.53,74.93 13.66,74.93 S1.3 10.16,71.45 v10.16,100.46 | C1.2 141.1,57.15 | 141.1,57.15 C2.2 | C7.2 R5.1 53.34,44.32 C17.2 | C6.2 171.2,37.08 167.91,40.37 C5.2 149.73,43.31 | 149.73,43.31 144.78,48.26 | C11.2 40.64,24.13 62.23,24.13 73.79,35.69 C9.2 | VERIFIER_TYPE.3 82.93,80.01 118.24,80.01 141.1,57.15
  Bottom 0.508: S1.3 S1.4 11.6,63.53 USB.1-1 9.85,47.95 6.35,44.45 6.35,35.56 7.62,34.29 16.51,34.29 21.59,39.37 IC2.2 | 10.18,100.48 v10.16,100.46 16.71,100.46 B2.-1 | U$2.1 93.36,26.67 78.74,26.67 77.47,27.94 77.47,35.18 U$2.32 | X4.1 58.38,115.8 C21.- 56.88,112.03 R21.1 | X3.1 142.2,114.53 C19.- 144.78,108.95 R19.2 | X5.1 96.48,115.8 C23.- 100.33,108.95 R23.1
  pour Top (isolate 3.81): 0,129.54 0,0 189.23,0 189.23,129.54
  pour Bottom (isolate 3.81): 0,129.54 0,0 189.23,0 189.23,129.54
MCU_RESET  (via drill 0.9)
  Top 0.305: U1.29 165.18,51.66 164.96,51.44 161.03,51.44 v159.39,53.09
  Top 0.508: C7.1 R3.1 | R3.1 | VERIFIER_TYPE.1 65.9,65.52 R3.1
  Bottom 0.508: S1.2 S1.1 15.55,70.61 VERIFIER_TYPE.1 81.66,81.28 119.38,81.28 140.97,59.69 JP2.1 153.67,58.8 v159.39,53.09
N$1
  Top 0.254: U$1.10 136.85,48.33
  Top 0.508: R1.2 136.85,44.89 136.85,48.33
N$2
  Top 0.305: U1.20 171.86,58.59 C4.1
N$3  (via drill 0.9)
  Top 0.305: R2.2 175.39,43.43 174.24,44.57 U1.8
  Top 0.508: R2.2 v175.26,38.87 v175.26,38.86 174.87,38.47 174.87,38.35 C6.1
  Bottom 0.508: v175.26,38.86 175.26,33.15 Q1.2
N$4  (via drill 0.9)
  Top 0.305: U1.7 173.46,44.3 R2.1
  Top 0.508: R2.1 C5.1 169.66,40.83 170.48,40.01 v171.58,40.01
  Bottom 0.508: v171.58,40.01 171.58,34.29 Q1.1
N$6
  Top 0.508: R17.1 R16.2 C11.1
N$7
  Top 0.508: AT1.2 85.09,7.62 83.82,8.89 83.82,10.16 85.09,11.43 90.18,11.43 92.33,13.57 92.33,14.35 | AT1.7 85.09,20.32 83.82,19.05 83.82,17.78 85.09,16.51 90.69,16.51 91.44,15.76 91.44,15.24 92.33,14.35 | 92.33,14.35 C14.1
N$8
  Top 0.508: R16.1 77.47,11.43 78.74,10.16 78.74,8.89 77.47,7.62 AT1.15
N$9
  Top 0.508: R17.2 72.39,15.24 73.66,16.51 77.47,16.51 78.74,17.78 78.74,19.05 77.47,20.32 AT1.10
N$10
  Top 0.508: U$2.19 82.76,68.03 80.01,65.28 80.01,62.23 78.61,60.83 R4.1
N$11
  Bottom 1.27: X2.2 31.67,114.26 31.67,114.3 36.6,109.37 B2.AC1-
N$12
  Bottom 1.27: X2.1 10.12,109.22 7.62,109.22 6.35,107.95 6.35,85.09 8.89,82.55 17.78,82.55 17.63,82.4 B2.AC2-
N$13
  Top 0.508: IC3.3 134.62,101.21 C18.1 130.81,101.6 R18.1
N$15
  Top 0.508: IC4.3 52.07,102.47 C20.1 48.26,102.87 R20.1
N$18
  Top 0.508: IC5.3 90.17,102.47 C22.1 86.36,102.87 R22.1
N$25
  Top 0.508: R5.2 R4.2 77.34,63.63 VERIFIER_TYPE.2
N$28  (via drill 0.9)
  Top 0.508: IP4220CZ6.3 38.29,48.45 v40.77,45.97
  Bottom 0.305: 16.51,41.91 15.02,41.91 14.74,42.2 12.85,42.2 USB.1-3
  Bottom 0.508: 41.91,46.03 27.17,46.03 23.05,41.91 16.51,41.91 | 41.91,46.03 U$2.30 | v40.77,45.97 41.85,45.97 41.91,46.03
N$30  (via drill 0.9)
  Top 0.508: IP4220CZ6.4 31.68,48.51 v24.26,48.51
  Bottom 0.305: 16.51,48.03 16.06,48.03 14.74,46.7 12.85,46.7 USB.1-2
  Bottom 0.508: U$2.29 61.46,48.03 60.95,48.54 24.26,48.54 | 24.26,48.54 17.02,48.54 16.51,48.03 | v24.26,48.51 24.26,48.54
N$36
  Top 0.508: AT1.3 R15.2 90.04,6.35 84.46,6.35 81.91,8.89 81.91,28.57 87.63,34.29 87.63,55.88 85.48,58.03 U$2.24
N$37  (via drill 0.9)
  Top 0.508: R14.2 AT1.1 83.82,5.08 80.01,8.89 v80.01,30.48
  Bottom 0.508: v80.01,30.48 83.82,34.29 86.36,34.29 92.71,40.64 92.71,52.91 85.59,60.03 U$2.23
N$38
  Top 0.508: AT1.8 R13.2 88.77,27.94 88.77,57.58 U$2.22
N$39  (via drill 0.9)
  Top 0.508: AT1.6 R12.2 90.04,21.59 85.09,21.59 83.82,22.86 83.82,26.67 v86.36,29.21
  Bottom 0.508: v86.36,29.21 93.98,36.83 93.98,54.61 84.56,64.03 U$2.21
N$40  (via drill 0.9)
  Top 0.508: AT1.16 v38.1,5.08
  Bottom 0.508: X1.1 13.97,18.41 13.97,8.89 17.78,5.08 v38.1,5.08
N$41  (via drill 0.9)
  Top 0.508: AT1.14 71.12,10.16 68.62,7.66 32.98,7.66 26.67,13.97 v26.67,16.51
  Bottom 0.508: v26.67,16.51 22.23,16.51 X1.2
N$42  (via drill 0.9)
  Top 0.508: AT1.11 74.07,19.05 v31.75,19.05
  Bottom 0.508: X1.3 16.51,19.05 19.05,21.59 20.32,21.59 22.86,19.05 v31.75,19.05
N$43  (via drill 0.9)
  Top 0.508: AT1.9 74.07,21.59 48.26,21.59 v45.72,21.59
  Bottom 0.508: v45.72,21.59 41.91,21.59 34.93,14.6 X1.6
N$47
  Top 0.508: R12.1 R13.1 100.22,22.86 C12.1
N$48
  Top 0.508: R14.1 R15.1 C13.1
OM_IO15
  Top 0.305: U$2.7 111.91,50.84 U$1.7
OM_IO16  (via drill 0.9)
  Top 0.305: U$1.9 136.81,49.5 134.61,49.5 133.37,48.26 v114.3,48.26
  Bottom 0.305: U$2.6 112.49,48.26 v114.3,48.26
OM_IO17
  Top 0.305: U$2.5 126.73,50.03 126.85,50.15 136.81,50.15 U$1.8
OM_RXD1
  Top 0.305: U$2.8 113.25,51.49 U$1.6
OM_SCI  (via drill 0.9)
  Top 0.305: U$1.3 136.83,53.47 131.31,53.47 129.06,55.72 126.65,55.72 126.62,55.75 v125.35,55.75
  Bottom 0.508: U$2.18 87.81,70.03 95.25,77.47 110.49,77.47 125.35,62.61 v125.35,55.75
OM_SDA  (via drill 0.9)
  Top 0.305: v127.64,53.47 128.27,52.83 136.81,52.83 U$1.4
  Bottom 0.406: 127.64,53.98 v127.64,53.47
  Bottom 0.508: U$2.17 85.43,72.03 85.53,71.94 87.51,71.94 88.91,73.34 88.91,73.68 93.98,78.74 111.76,78.74 127.64,62.87 127.64,53.98
OM_TXD1
  Top 0.305: U$2.9 114.61,52.15 U$1.5
TP_3.3_OMEGA
  Bottom 0.305: U$2.25 84.3,56.01 JP1.1
VIN_7805
  Top 0.508: IC3.1 139.7,93.98 137.16,91.44 101.6,91.44 IC5.1 95.25,95.25 91.96,91.96 C15.+ 77.47,92.09 C16.1 68.84,91.96 61.71,91.96 IC4.1
  Bottom 0.508: IC2.1 41.91,41.91 43.18,40.64 43.18,33.02 40.64,30.48 3.81,30.48 2.54,31.75 2.54,69.62 9.12,76.2 25.63,76.2 B2.+1
  Bottom 1.27: IC4.1 57.15,92.71 51.13,86.69 B2.+1

### Text on the board
Top: - | - | - | + | + | + | 13 | GPIO | 2 | 5V | GND | 3.3V | 5V | Benoit Houle / 2 mars 2020 / Rev1
Bottom: 3.3V
Cartouche: Projet final | \Projet Final\Eagle | 1 | 1 | 1 | Arduino | 1 | 1